# Altium schematic sheet Face_InBack1V0.SchDoc
size A3
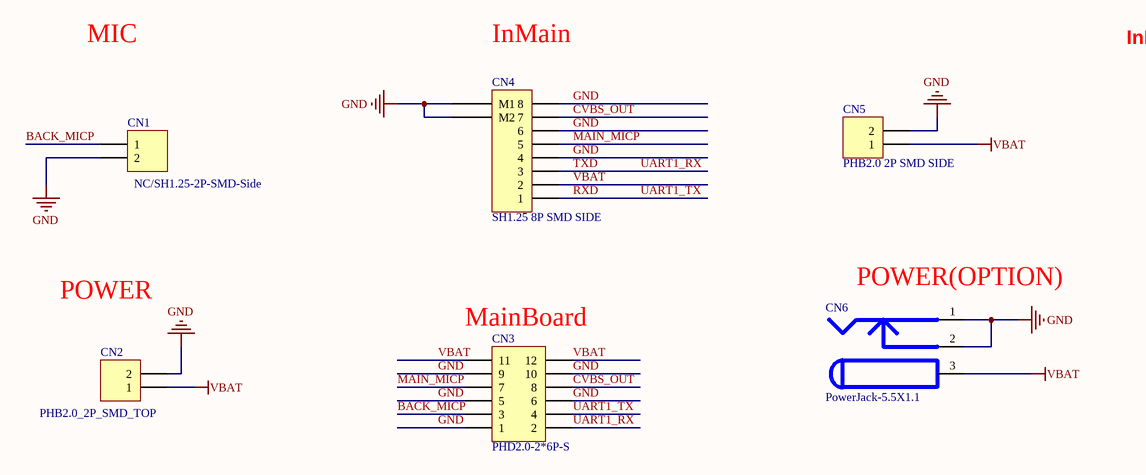
[diagram p0: Face_InBack1V0.SchDoc]

## Parts
CN1  NC/SH1.25-2P-SMD-Side  [SH1.25_2P_SMD_SIDE]
CN2  PHB2.0_2P_SMD_TOP  [PH2.0_2P_SMD_TOP]
CN3  PHD2.0-2*6P-S  [PHD2.0-2*6P-S]
CN4  SH1.25 8P SMD SIDE  [SH1.25_8P_SMD_SIDE]
CN5  PHB2.0 2P SMD SIDE  [PH2.0_2P_SMD_SIDE]
CN6  PowerJack-5.5X1.1  [POWER_CONNECT5.5X2.1]

## Nets
GND: CN1.2 CN2.2 CN3.1 CN3.5 CN3.6 CN3.9 CN3.10 CN4.4 CN4.6 CN4.8 CN4.M1 CN4.M2 CN5.2 CN6.1 CN6.2
VBAT: CN2.1 CN3.11 CN3.12 CN4.2 CN5.1 CN6.3
BACK_MICP: CN1.1 CN3.3
CVBS_OUT: CN3.8 CN4.7
MAIN_MICP: CN3.7 CN4.5
RXD: CN3.4 CN4.1  [also labelled UART1_TX]
TXD: CN3.2 CN4.3  [also labelled UART1_RX]

## Notes on the sheet
- MIC
- InMain
- InMain Power(OPTION)
- POWER
- (near CN3) MainBoard
- (near CN6) POWER(OPTION)
- Title
- Size:
- Date:
- A3
- Number:
- Time:
- Revision:
- Sheet
- of
- File:

## Library data of the parts
CN1 = Header2: SH1.25-2P-SMD-Side; 物料编号: ECZ02035; 名称: 弯针插座; 规格，型号: PH 2Pin 间距2.0mm DIP/90°; name1: PH2.0-2P-DIP-180; Parameter 2: PH2.0-2P-SMD-Side; Parameter 1: SH1.25-2P-SMD-Side
CN2 = Header2: XH2.54-2P-SMD-Top, 带扣
CN3 = PHD 2*6P
CN4 = Header 8: FPC8_0.5; LatestRevisionDate: 17-Jul-2002; LatestRevisionNote: Re-released for DXP Platform.; Publisher: Altium Limited
CN5 = Header 2: PHB2.0 2P 90; LatestRevisionDate: 17-Jul-2002; LatestRevisionNote: Re-released for DXP Platform.; Publisher: Altium Limited
CN6 = PowerJack-5.5X1.1: IC